# Altium schematic sheet NEB_USRIO.SchDoc
size A4; Organization: Altium Limited; Address1: L3, 12a Rodborough Rd; Address2: Frenchs Forest; Address3: NSW; Address4: Australia 2086; DocumentNumber: 6; SheetNumber: 6; SheetTotal: 10
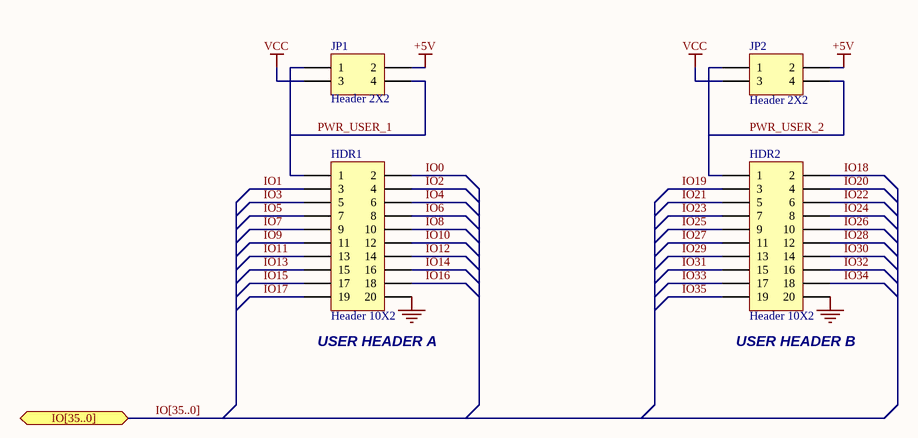
[diagram p0: NEB_USRIO.SchDoc]

## Parts
HDR1  Header 10X2  [HDR2X10]
HDR2  Header 10X2  [HDR2X10]
JP1  Header 2X2  [HDR2X2_B]
JP2  Header 2X2  [HDR2X2_B]

## Ports
IO[35..0] (bidir)

## Nets
+5V: JP1.2 JP2.2
GND: HDR1.20 HDR2.20
VCC: JP1.3 JP2.3
IO0: HDR1.2
IO1: HDR1.3
IO2: HDR1.4
IO3: HDR1.5
IO4: HDR1.6
IO5: HDR1.7
IO6: HDR1.8
IO7: HDR1.9
IO8: HDR1.10
IO9: HDR1.11
IO10: HDR1.12
IO11: HDR1.13
IO12: HDR1.14
IO13: HDR1.15
IO14: HDR1.16
IO15: HDR1.17
IO16: HDR1.18
IO17: HDR1.19
IO18: HDR2.2
IO19: HDR2.3
IO20: HDR2.4
IO21: HDR2.5
IO22: HDR2.6
IO23: HDR2.7
IO24: HDR2.8
IO25: HDR2.9
IO26: HDR2.10
IO27: HDR2.11
IO28: HDR2.12
IO29: HDR2.13
IO30: HDR2.14
IO31: HDR2.15
IO32: HDR2.16
IO33: HDR2.17
IO34: HDR2.18
IO35: HDR2.19
PWR_USER_1: HDR1.1 JP1.1 JP1.4
PWR_USER_2: HDR2.1 JP2.1 JP2.4

## Buses and harness runs
bus IO[35..0] = port IO[35..0]

## Notes on the sheet
- (near HDR1) USER HEADER A
- (near HDR2) USER HEADER B
- Title
- Size:
- Date:
- A4
- Number:
- Time:
- Revision:
- Sheet
- of
- File:

## Library data of the parts
HDR1 HDR2 = Header 10X2: Header, 10-Pin, Dual row; Manufacturer: Generic Components; Class I: Connector; Fitted: True; Revision: July-2002: Re-released for DXP Platform.; Publisher: Altium Limited
JP1 JP2 = Header 2X2: Header, 2-Pin, Dual row; Manufacturer: Generic Components; Class I: Connector; Fitted: True; Revision: July-2002: Re-released for DXP Platform.; Publisher: Altium Limited